# Altium schematic sheet Power circuit.SchDoc
size A3; SheetNumber: 4; SheetTotal: 7
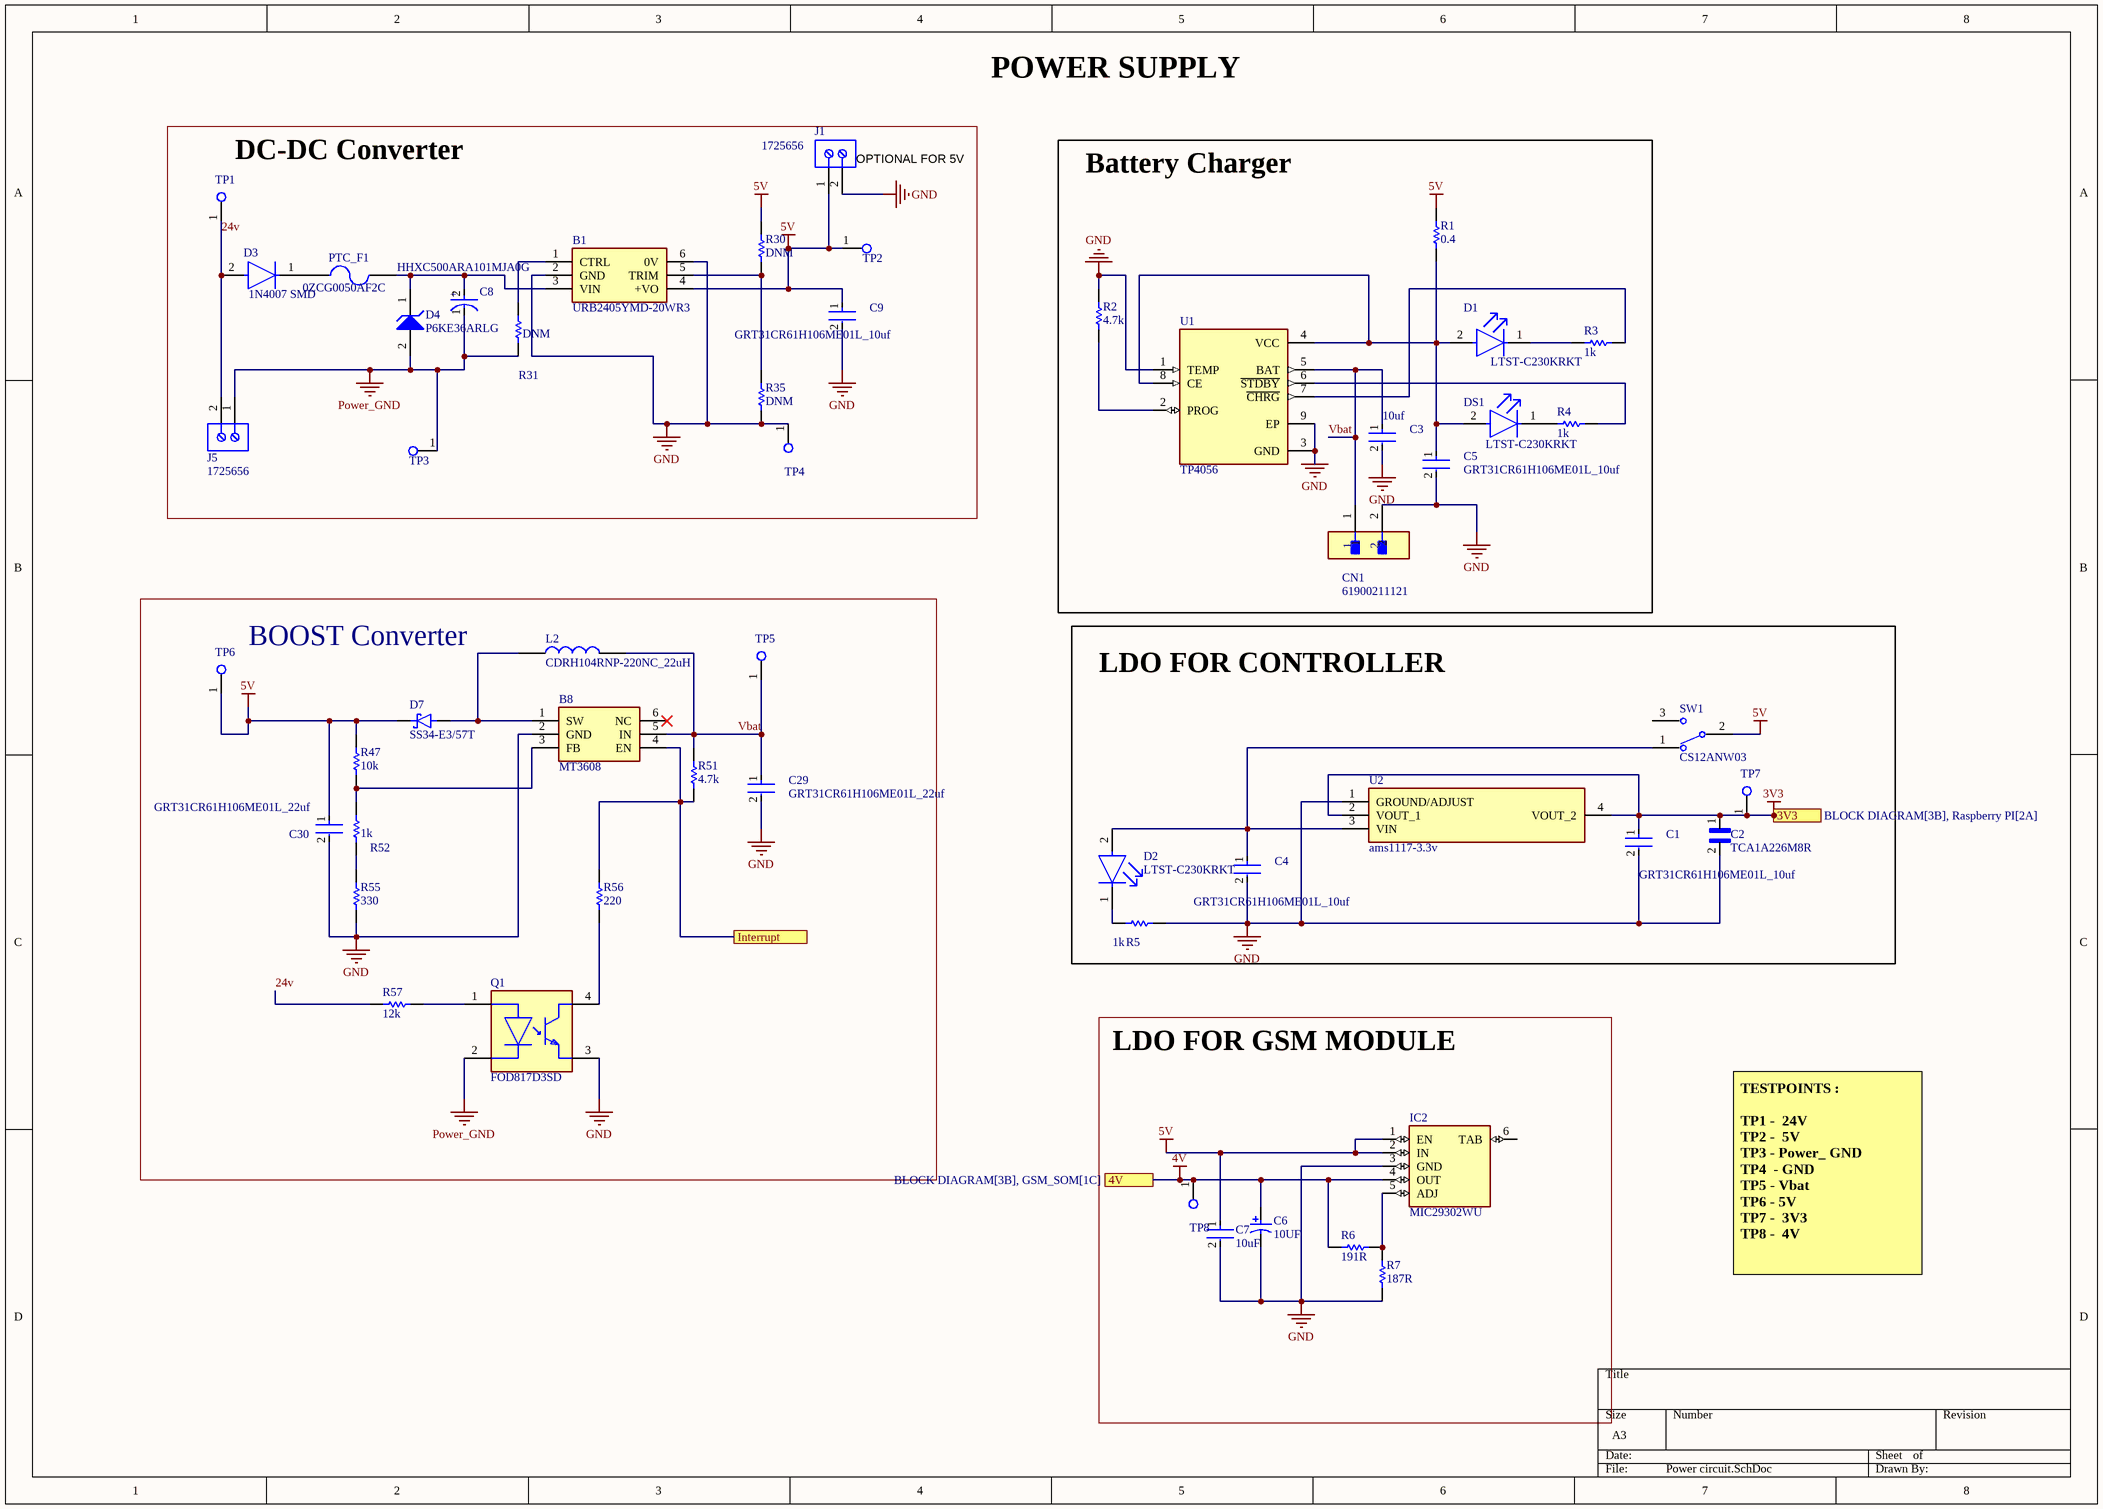
[diagram p0: Power circuit.SchDoc]

## Parts
B1  URB2405YMD-20WR3  [URB2405YMD20WR3]
B8  MT3608  [SOT95P280X145-6N]
C1  GRT31CR61H106ME01L_10uf  [FP-GRT31C-0_2-MFG]
C2  TCA1A226M8R  [RESC3216X65N]
C3  10uf  [FP-GRT31C-0_2-MFG]
C4  GRT31CR61H106ME01L_10uf  [FP-GRT31C-0_2-MFG]
C5  GRT31CR61H106ME01L_10uf  [FP-GRT31C-0_2-MFG]
C6  10UF  [KEMT-A-3216-18-2_M]
C7  10uF  [FP-CL05A106MP5NUNC-MFG]
C8  HHXC500ARA101MJA0G  [FP-HXC-ALA0-MFG]
C9  GRT31CR61H106ME01L_10uf  [FP-GRT31C-0_2-MFG]
C29  GRT31CR61H106ME01L_22uf  [FP-GRT31C-0_2-MFG]
C30  GRT31CR61H106ME01L_22uf  [FP-GRT31C-0_2-MFG]
CN1  61900211121  [FP-61900211121-MFG]
D1  LTST-C230KRKT  [FP-LTST-C230KRKT-MFG]
D2  LTST-C230KRKT  [FP-LTST-C230KRKT-MFG]
D3  1N4007 SMD  [FP-1N4007_SMD-IPC_C]
D4  P6KE36ARLG  [ONSC-SURMETIC40-2-017AA-01]
D7  SS34-E3/57T  [DIOM7959X262N]
DS1  LTST-C230KRKT  [FP-LTST-C230KRKT-MFG]
IC2  MIC29302WU  [MIC29302WU]
J1  1725656  [PHOE-1725656-2]
J5  1725656  [PHOE-1725656-2]
L2  CDRH104RNP-220NC_22uH  [INDPM102100X400N]
PTC_F1  0ZCG0050AF2C  [F1812]
Q1  FOD817D3SD  [FP-709AH-MFG]
R1  value 0.4  [RESC3216X60X45ML15T20]  (hidden comment: Resistor 0R +/- 5% 1206 250 mW)
R2  value 4.7k  [RESC3216X60X45ML15T20]  (hidden comment: Resistor 0R +/- 5% 1206 250 mW)
R3  value 1k  [RESC3216X60X45ML15T20]  (hidden comment: Resistor 0R +/- 5% 1206 250 mW)
R4  value 1k  [RESC3216X60X45ML15T20]  (hidden comment: Resistor 0R +/- 5% 1206 250 mW)
R5  value 1k  [RESC3216X60X45ML15T20]  (hidden comment: Resistor 0R +/- 5% 1206 250 mW)
R6  191R  [RESC1005X40X25ML05T05]
R7  187R  [RESC1005X35X20LL05T10]
R30  0: DNM  [RESC3216X60X45ML15T20]  (hidden comment: Resistor 0R +/- 5% 1206 250 mW)
R31  0: DNM  [RESC3216X60X45ML15T20]  (hidden comment: Resistor 0R +/- 5% 1206 250 mW)
R35  0: DNM  [RESC3216X60X45ML15T20]  (hidden comment: Resistor 0R +/- 5% 1206 250 mW)
R47  value 10k  [RESC3216X60X45ML15T20]  (hidden comment: RC1206JR-074K7L)
R51  value 4.7k  [RESC3216X60X45ML15T20]  (hidden comment: RC1206JR-074K7L)
R52  value 1k  [RESC3216X60X45ML15T20]  (hidden comment: RC1206JR-072KL)
R55  value 330  [RESC3216X60X45ML15T20]  (hidden comment: RC1206JR-0747KL)
R56  value 220  [RESC3216X60X45ML15T20]  (hidden comment: RC1206JR-07220RL)
R57  value 12k  [RESC3216X60X45ML15T20]  (hidden comment: RC1206JR-0712KL)
SW1  CS12ANW03  [FP-CS12ANW03-MFG]
TP1  Test Point  [TEST_POINT_SMD_30D]  (value not drawn)
TP2  Test Point  [TEST_POINT_SMD_30D]  (value not drawn)
TP3  Test Point  [TEST_POINT_SMD_30D]  (value not drawn)
TP4  Test Point  [TEST_POINT_SMD_30D]  (value not drawn)
TP5  Test Point  [TEST_POINT_SMD_30D]  (value not drawn)
TP6  Test Point  [TEST_POINT_SMD_30D]  (value not drawn)
TP7  Test Point  [TEST_POINT_SMD_30D]  (value not drawn)
TP8  Test Point  [TEST_POINT_SMD_30D]  (value not drawn)
U1  TP4056  [SOP127P600X175-9N]
U2  ams1117-3.3v  [SOT229P700X180-4N]

## Blocks framed on the sheet
DC-DC Converter: B1 C8 C9 D3 D4 J1 J5 PTC_F1 R30 R31 R35 TP1-TP4
Battery Charger: C3 C5 CN1 D1 DS1 R1-R4 U1
BOOST Converter: B8 C29 C30 D7 L2 Q1 R47 R51 R52 R55-R57 TP5 TP6
LDO FOR CONTROLLER: C1 C2 C4 D2 R5 SW1 TP7 U2
LDO FOR GSM MODULE: C6 C7 IC2 R6 R7 TP8

## Ports
3V3 (see BLOCK DIAGRAM[3B], Raspberry PI[2A]), 4V (see BLOCK DIAGRAM[3B], GSM_SOM[1C]), Interrupt

## Nets
3V3: C1.1 C2.1 TP7.1 U2.2(VOUT_1) U2.4(VOUT_2) ; port 3V3
4V: C6.1 IC2.4(OUT) R6.1 TP8.1 ; port 4V
5V: B1.4(+VO) C7.1 C9.1 C30.1 D7.C IC2.1(EN) IC2.2(IN) J1.1 R1.2 R30.2 R47.2 SW1.2(2(COM)) TP2.1 TP6.1
GND: B1.2(GND) B1.6(0V) B8.2(GND) C1.2 C2.2 C3.2 C4.2 C5.2 C6.2 C7.2 C9.2 C29.2 C30.2 CN1.2 IC2.3(GND) J1.2 Q1.3(E) R2.2 R5.1 R7.1 R35.1 R55.1 TP4.1 U1.1(TEMP) U1.3(GND) U1.9(EP) U2.1(GROUND/ADJUST)
Power_GND: C8.1(C) D4.2(A) J5.1 Q1.2(C) R31.1 TP3.1
24v: D3.2(A) J5.2 R57.2 TP1.1
Interrupt: B8.4(EN) R51.1 R56.2 ; port Interrupt
Vbat: B8.5(IN) C3.1 C29.1 CN1.1 L2.2 R51.2 TP5.1 U1.5(BAT)
NetB1_1: B1.1(CTRL) R31.2
NetB1_3: B1.3(VIN) C8.2(A) D4.1(K) PTC_F1.2
NetB1_5: B1.5(TRIM) R30.1 R35.2
NetB8_1: B8.1(SW) D7.A L2.1
NetB8_3: B8.3(FB) R47.1 R52.2
NetC4_1: C4.1 D2.2(A) SW1.1 U2.3(VIN)
NetC5_1: C5.1 D1.2(A) DS1.2(A) R1.1 U1.4(VCC) U1.8(CE)
NetD1_1: D1.1(C) R3.2
NetD2_1: D2.1(C) R5.2
NetD3_1: D3.1(C) PTC_F1.1
NetDS1_1: DS1.1(C) R4.2
NetIC2_5: IC2.5(ADJ) R6.2 R7.2
NetQ1_1: Q1.1(A) R57.1
NetQ1_4: Q1.4(C) R56.1
NetR2_1: R2.1 U1.2(PROG)
NetR3_1: R3.1 U1.7(~{CHRG})
NetR4_1: R4.1 U1.6(~{STDBY})
NetR52_1: R52.1 R55.2

Not connected (* = marked no-connect by the designer): B8 6(NC)*; IC2 6(TAB); SW1 3

## Notes on the sheet
- POWER SUPPLY
- (near J1) OPTIONAL FOR 5V
- TESTPOINTS :
  TP1 -  24V
  TP2 -  5V
  TP3 - Power_ GND
  TP4  - GND
  TP5 - Vbat
  TP6 - 5V
  TP7 -  3V3
  TP8 -  4V
- (in symbol CMP-33769-000007-1) +

## Library data of the parts
B1 = URB2405YMD-20WR3: 20W isolated DC-DC converter DIP package, Ultra-wide input and regulated single output; Manufacturer_Name: Mornsun Power; Geometry.Height: 12.2mm; Manufacturer_Part_Number: URB2405YMD-20WR3; Mouser Part Number: *; Mouser Price/Stock: *; Arrow Part Number: *; Arrow Price/Stock: *; Datasheet Link: https://4donline.ihs.com/images/VipMasterIC/IC/MNSN/MNSN-S-A0014923150/MNSN-S-A0014923730-1.pdf?hkey=EF798316E3902B6ED9A73243A3159BB0
B8 = MT3608: High Efficiency 1.2MHz 2A Step Up Converter; Manufacturer_Name: Aerosemi; Geometry.Height: 1.45mm; Manufacturer_Part_Number: MT3608; Mouser Part Number: *; Mouser Price/Stock: *; Arrow Part Number: *; Arrow Price/Stock: *; Datasheet Link: https://www.olimex.com/Products/Breadboarding/BB-PWR-3608/resources/MT3608.pdf
C1 C3-C5 C9 C29 C30 = CMP-06035-048951-1: CAP CER 10UF 50V X5R 1206; Tolerance: 20%; Length: 0.126inch; Mount: Surface Mount; Packaging: Tape and Reel; Capacitance: 10uF; Case/Package: 1206; Case Code (Imperial): 1206; Max Operating Temperature: 85°C; Voltage Rating: 50V; Ratings: AEC-Q200; Min Operating Temperature: -55°C; Thickness: 0.071inch; Width: 0.063inch; Case Code (Metric): 3216
C2 = TCA1A226M8R: 22ÂµF Molded Tantalum Capacitors 10V 1206 (3216 Metric); MF: Rohm; Price: None; Availability: Unavailable; SnapEDA_Link: https://www.snapeda.com/parts/TCA1A226M8R/Rohm/view-part/1738219/?ref=snap; Value: *; Package: 1206 Rohm; MP: TCA1A226M8R
C6 = CMP-2000-05172-1: Capacitor, Tantalum, 10 uF, +/- 10%, 10 V, -55 to 125 degC, 2-Pin SMD (1206), RoHS, Tape and Reel; Manufacturer Size Code: A; Manufacturer: Kemet; Type: Molded; Online Catalog: T491Series; Other Names: 399-3684-2; Voltage - Rated: 10V; Lifetime @ Temp.: 2000Hrs@85degC; Product Training Modules: CapacitorBasics-TypicalUsesforCapacitorsDeratingGuidelinesforSurfaceMountTantalumCapacitors; ESR (Equivalent Series Resistance): 3.8Ohm; Capacitance: 10µF; Catalog Drawings: T49x,T5xxSeries_A-side1T49x,T5xxSeries_A,B-side2T49x,T5xxSeries_A,SBottom; Family: TantalumCapacitors; Manufacturer URL: http://www.kemet.com/; Datasheet URL: http://www.farnell.com/datasheets/1824869.pdf; Package Reference: 1206; Packaging: Tape&Reel(TR); Series: T491; Operating Temperature: -55degC~125degC; Mounting Type: SurfaceMount; Height - Seated (Max): 0.071"(1.80mm); Package / Case: 1206(3216Metric); Package Description: 2-Pin Surface Mount Device, Body 3.2 x 1.6 mm; Features: GeneralPurpose; Tolerance: ±10%; Lead Spacing: -; Size / Dimension: 0.126"Lx0.063"W(3.20mmx1.60mm); Standard Package: 2,000; Datasheet Version: Apr-14; Category: Capacitors
C7 = CMP-13271-000002-1: CAP CER 10UF 10V X5R 0402; Manufacturer Part Number: CL05A106MP5NUNC; Manufacturer: Samsung; Temperature Coefficient: 15%; Tolerance: 20%; Material: Ceramic; Octopart: https://octopart.com/cl05a106mp5nunc-samsung-22457395; Voltage Rating: 10V; RoHS: TRUE; Value: 10uF; Height: 0.7mm; Digikey Description: CAP CER 10UF 10V X5R 0402; Automotive: No; Package: CL05A106MP5NUNC; Device Class L1: Passive Components; Capacitance: 10uF; Temperature Range High: +85°C; ComponentLink2Description: Datasheet; Device Class L2: Capacitors; Temperature Characteristic: X5R; Temperature: -55°C to +85°C; ComponentLink2URL: http://www.samsungsem.com/kr/support/product-search/mlcc/__icsFiles/afieldfile/2019/05/10/19-CL05A106MP5NUNC.pdf; Device Class L3: Ceramic Capacitors; Category: Cap; Temperature Range Low: -55°C; Ipc Land Pattern Name: CAPC10050X50; Lead Free: Yes
C8 = CMP-33769-000007-1: CAP ALUM POLY 100UF 20% 50V SMD; Life (Hours): 4000Hour; ESR (Equivalent Series Resistance): 25mR; Packaging: Cut Tape; Case/Package: Radial; Capacitance: 100uF; Resistor Type: Hybrid; Max Operating Temperature: 125°C; Voltage Rating: 50V; Min Operating Temperature: -55°C; RoHS Compliant: Yes; Tolerance: 20%; Ratings: AEC-Q200; Mount: Surface Mount
CN1 = CMP-1502-00584-2: CONN HEADER VERT 2POS 2.54MM; Number of Contacts: 2; Gender: Male; Current Rating: 3A; Voltage Rating: 250V; Insulation Resistance: 1GR; Contact Material: Copper Alloy; Package Quantity: 1000; Color: Beige; Mount: Through Hole; Termination: Through Hole; Fastening Type: Friction; Contact Mating Length: 0.295inch; Pitch: 2.54mm; Max Operating Temperature: 105°C; Height: 14.2mm; RoHS Compliant: Yes; Packaging: Bulk; Contact Type: Male Pin; Width: 5.12mm; Housing Material: Nylon; Min Operating Temperature: -40°C; Insulation Material: Nylon; Contact Finish - Mating: TIN; Insulation Color: Beige; Contact Plating: Tin; Flammability Rating: UL94 V-0; Length: 5.8mm; Contact Gender: Male; Connector Type: Header; Contact Shape: Square; Series: WR-WTB; Number of Positions: 2; Number of Rows: 1
D1 D2 DS1 = CMP-22017-000041-1: LED RED CLEAR CHIP SMD; Dominant Wavelength: 631nm; Lens Color: Colorless; Lens Style: Diffused; Forward Voltage: 2V; Test Current: 20mA; Luminous Intensity: 54mcd; Number of LEDs: 1; Viewing Angle: 130°; Power Rating: 75mW; Forward Current: 30mA; Wavelength: 639nm; Reverse Voltage: 5V; Min Operating Temperature: -55°C; Height: 1.1mm; Length: 3.2mm; Lens Transparency: Clear; Case/Package: 1206; Package Quantity: 1; Width: 1.6mm; Max Operating Temperature: 85°C; Packaging: Tape and Reel; RoHS Compliant: Yes; Mount: Surface Mount; Lead Free: Lead Free; Depth: 1.6mm; Power Dissipation: 75mW; Number of Pins: 2; Number of Elements: 1; Color: Red; Illumination Color: Red; Case Code (Imperial): 1206; Case Code (Metric): 3216; Radiation Hardening: No
D3 = CMP-12389-000001-1: Rectifier, 1Kv, 1A, Do-214Ac Rohs Compliant: Yes
D4 = CMP-1061-00690-1: 600 W Peak Power Transient Voltage Suppressor, 2-Pin Surmetic(TM) 40, Pb-Free, Tape and Reel; Manufacturer: On Semiconductor; V(BR) Typ (V): 36; PPK Max (W): 600; IR Max (uA): 5; Direction: Unidirectional; Packing: Tape and Reel; PackageReference: SURMETIC40-2-017AA-01; ComponentLink1Description: Manufacturer URL; ComponentLink3Description: Package Specification; RoHS: Pb-Free; ComponentLink2Description: Datasheet; PackageDescription: 2-Pin, Axial Lead, Diameter 3.49 mm; ComponentLink2URL: http://www.onsemi.com/pub_link/Collateral/P6KE6.8A-D.PDF; Mounting Technology: Through Hole; ComponentLink1URL: http://www.onsemi.com/; PartNumber: P6KE36ARLG; ComponentLink3URL: http://www.onsemi.cn/pub_link/Collateral/017AA.PDF; PackageVersion: Rev. O, 09/2005; DatasheetVersion: Rev. 10
D7 = SS34-E3/57T: Diode Schottky 40 V 3A Surface Mount DO-214AB (SMC); MF: Vishay General Semiconductor; SnapEDA_Link: https://www.snapeda.com/parts/SS34-E3/57T/General+Semiconductor/view-part/?ref=snap; Availability: In Stock; Check_prices: https://www.snapeda.com/parts/SS34-E3/57T/General+Semiconductor/view-part/?ref=eda; Value: *; Package: None; Purchase-URL: https://pricing.snapeda.com/search/part/SS34-E3/57T/?ref=eda; MP: SS34-E3/57T; Price: None
IC2 = MIC29302WU: Linear Voltage Regulator IC Positive Adjustable 1 Output 3A TO-263-5; MF: Microchip Technology; SnapEDA_Link: https://www.snapeda.com/parts/MIC29302WU/Microchip/view-part/?ref=snap; Package: TO-263-6 Microchip Technology / Micrel; Value: *; MP: MIC29302WU; Check_prices: https://www.snapeda.com/parts/MIC29302WU/Microchip/view-part/?ref=eda
J1 J5 = CMP-2000-05299-1: Male Header, Pitch 2.54 mm, 1 x 2 Position, Height 9 mm, Tail Length 3.5 mm; Manufacturer: Phoenix Contact; Number of contacts: 2; Content: 250pc(s); Pitch: 2.54mm; Industrial packaging: Yes; Colour: Green; Manufacturer part No.: 1725656; Type: MPT0,5/2-2,54; Datasheet URL: http://datasheet.octopart.com/1725656-Phoenix-Contact-datasheet-5302866.pdf; Manufacturer URL: http://www.phoenixcontact.com/; Datasheet Version: Apr-08
L2 = CDRH104RNP-220NC: Fixed Inductors 22uH 2.5A; Manufacturer_Name: Sumida; Geometry.Height: 4mm; Manufacturer_Part_Number: CDRH104RNP-220NC; Mouser Part Number: 851-CDRH104RNP-220NC; Mouser Price/Stock: https://www.mouser.co.uk/ProductDetail/Sumida/CDRH104RNP-220NC?qs=iXFGfj0UVr7lF4yqUlpBKQ%3D%3D; Arrow Part Number: CDRH104RNP-220NC; Arrow Price/Stock: https://www.arrow.com/en/products/cdrh104rnp-220nc/sumida?region=nac; Datasheet Link: http://products.sumida.com/products/pdf/CDRH104R.pdf
PTC_F1 = Fuse 2: PTC RESET FUSE 30V 500MA 1812; MFG: Bel Fuse Inc.; ASSEMBLY_TYPE: SMT; MACRO: Power Management; MFG_PN: 0ZCG0050AF2C; PACKAGE: SMT; NOTE: *; KHK_AN: *
Q1 = CMP-07144-000021-1: OPTOISOLATOR 5KV TRANSISTOR 4SMD; Manufacturer: ON Semiconductor; Isolation Voltage: 5000Vrms; Reverse Voltage: 6V; Max Junction Temp: +125°C; Forward Current: 20mA; Collector Emitter Voltage: 70V; Forward Voltage: 1.2V; Min Current Transfer Ratio: 300%; Power Dissipation: 200mW; Max Current Transfer Ratio: 600%; Standoff Height: 0.35mm; Temperature: -55°C to +110°C; Category: Trans; ComponentLink2URL: https://www.onsemi.com/pub/Collateral/FOD814-D.PDF; Lead Free: Yes; ComponentLink2Description: Datasheet; Automotive: No; Mouser Description: Transistor Output Optocouplers Phototransistor Output; Octopart: https://octopart.com/fod817d3sd-on+semiconductor-84327552; Device Class L1: Optoelectronics; Height: 4.35mm; Device Class L2: Optocouplers; Device Class L3: unset; Manufacturer Part Number: FOD817D3SD; Temperature Range High: +110°C; Digikey Description: OPTOISOLATOR 5KV TRANSISTOR 4SMD; Footprint Url: https://www.onsemi.com/pub/Collateral/709AH.PDF; Temperature Range Low: -55°C; RoHS: TRUE; Package: 709AH; Emiiter Collector Voltage: 6V
R1-R5 R30 R31 R35 R47 R51 R52 R55-R57 = CMP-009-00002-5: Chip Resistor, 0 Ohm, +/- 5%, 0.25 W, -55 to 155 degC, 1206 (3216 Metric); Voltage Rating: 200V; Power: 250mW; Tolerance: 5%; Min Operating Temperature: -55°C; Mounting Technology: SM; Max Operating Temperature: 155°C; Case/Package: 1206; RoHS Compliant: True; Pins: 2
R6 = CMP-1011-00427-2: Manufacturer: Panasonic; Part Number: ERJ-2RKF1910X
R7 = CMP-2002-03161-1: Part Number: CPF0402B187RE1; Manufacturer: TE Connectivity / AMP
SW1 = CMP-31746-000002-1: SWITCH SLIDE SPDT 3A 125V; Max Voltage Rating (AC): 250V; Mechanical Life: 50000Cycles; Switch Travel: 2.2mm; Electrical Life: 20000Cycles; Actuator Length: 5.1mm; Illumination Type: Non-Illuminated; Contact Style: Non-Shorting; Actuator Type: Standard; Actuator Material: Nylon; Switch Function: On-On; Max Operating Temperature: 85°C; Series: CS; Contact Current Rating: 3A; Min Operating Temperature: -30°C; Current Rating: 3A; Mount: Through Hole; Depth: 7.5mm; RoHS Compliant: Yes; Throw Configuration: SPDT; Lead Free: Lead Free; Orientation: Vertical; Contact Plating: Silver; Reach SVHC Compliant: Yes; Termination: PC Pin; Max Current Rating: 3A; Packaging: Tray; Length: 14mm; Package Quantity: 1; Primary Type: SWITCH; Flammability Rating: UL94 V-0; Contact Material: Copper; Voltage Rating (AC): 125V
TP1-TP8 = TP: TEST POINT PC MINI .040"D RED; MFG: Keystone; MFG_PN: 5000; ASSEMBLY_TYPE: TH; MACRO: Power Management (VYS, 5V, 3.3V and Reset); PACKAGE: Assembly; TEMPERATURE: -55°C ~ 155°C
U1 = TP4056: Complete single cell Li-Ion battery with a constant current / constant voltage linear charger; MF: NanJing Top Power ASIC Corp.; Check_prices: https://www.snapeda.com/parts/TP4056/NanJing+Top+Power+ASIC+Corp./view-part/?ref=eda; SnapEDA_Link: https://www.snapeda.com/parts/TP4056/NanJing+Top+Power+ASIC+Corp./view-part/?ref=snap; Price: None; Availability: Not in stock; Package: Package; MP: TP4056; Value: *
U2 = ams1117-3.3v: 1A LOW DROPOUT VOLTAGE REGULATOR, SOT-223; Manufacturer_Name: Advanced Monolithic Systems; Geometry.Height: 1.8mm; Manufacturer_Part_Number: ams1117-3.3v; Mouser Part Number: *; Mouser Price/Stock: *; Arrow Part Number: *; Arrow Price/Stock: *; Datasheet Link: http://www.advanced-monolithic.com/pdf/ds1117.pdf